# Altium project DS157-1.2-B.PrjPcb
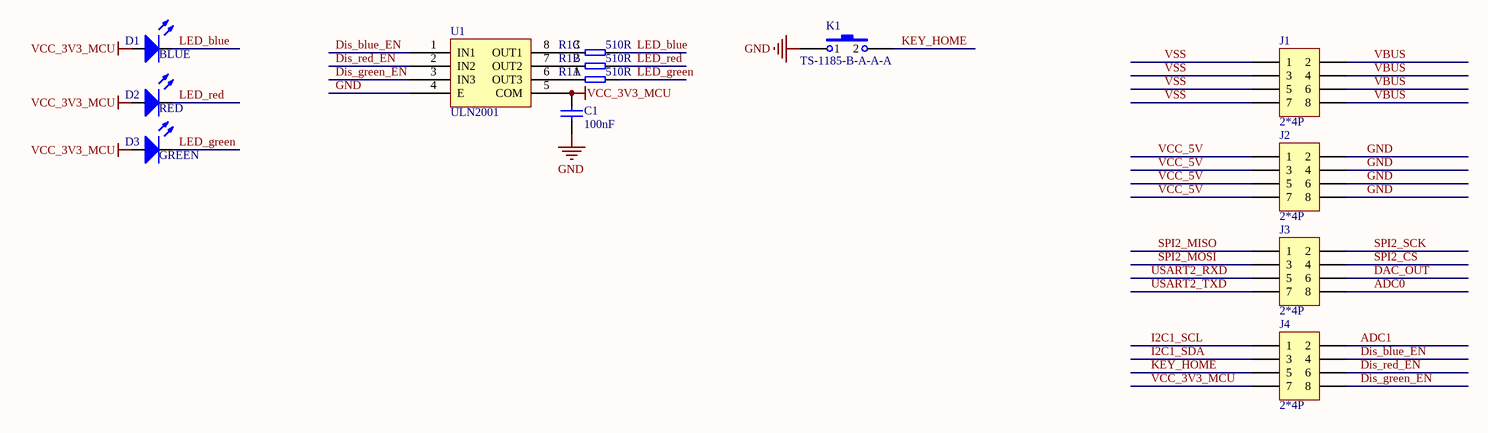
[diagram p0: DS157-1.2-B心率传感器.SchDoc]
2 sheets, 47 parts. Net scope: global (net labels, ports and power ports of the same name join across sheets).
Board files: DS157-1.2-B心率传感器.PcbDoc, DS157-1.2-C心率传感器.PcbDoc
Sheets:
  DS157-1.2-B心率传感器.SchDoc
  DS157-1.2-C心率传感器.SchDoc

## Sheet DS157-1.2-B心率传感器.SchDoc
size A4; SheetNumber: 1; SheetTotal: 1

### Parts
C1  value 100nF  [0603CAP]  (hidden comment: SMDCAP00013)
D1  value BLUE  [LED_0805]  (hidden comment: SMDLED00010)
D2  value RED  [LED_0805]  (hidden comment: SMDLED00003)
D3  value GREEN  [LED_0805]  (hidden comment: Chip 翠绿LED 0805)
J1  value 2*4P  [X1321WVS-2x04J-C40D53]  (hidden comment: X1321WVS-2x04J-C40D53)
J2  value 2*4P  [X1321WVS-2x04J-C40D53]  (hidden comment: X1321WVS-2x04J-C40D53)
J3  value 2*4P  [X1321WVS-2x04J-C40D53]  (hidden comment: X1321WVS-2x04J-C40D53)
J4  value 2*4P  [X1321WVS-2x04J-C40D53]  (hidden comment: X1321WVS-2x04J-C40D53)
K1  TS-1185-B-A-A-A  [KEY_TS-1185-x-A-A-A]
R1  value 510R  [0603RES_Pack4]  (hidden comment: SMDRES05003)  (parts A,B,C of 4)
U1  value ULN2001  [SO-8]  (hidden comment: SMDIC000018)

### Nets
GND: C1.1 J2.2 J2.4 J2.6 J2.8 K1.1 U1.4(E)
VCC_3V3_MCU: C1.2 D1.1(A) D2.1(A) D3.1(A) J4.7 U1.5(COM)
VCC_5V: J2.1 J2.3 J2.5 J2.7
ADC0: J3.8
ADC1: J4.2
DAC_OUT: J3.6
Dis_blue_EN: J4.4 U1.1(IN1)
Dis_green_EN: J4.8 U1.3(IN3)
Dis_red_EN: J4.6 U1.2(IN2)
I2C1_SCL: J4.1
I2C1_SDA: J4.3
KEY_HOME: J4.5 K1.2
LED_blue: D1.2(K) R1.6
LED_green: D3.2(K) R1.8
LED_red: D2.2(K) R1.7
SPI2_CS: J3.4
SPI2_MISO: J3.1
SPI2_MOSI: J3.3
SPI2_SCK: J3.2
USART2_RXD: J3.5
USART2_TXD: J3.7
VBUS: J1.2 J1.4 J1.6 J1.8
VSS: J1.1 J1.3 J1.5 J1.7
NetR1_1: R1.1 U1.6(OUT3)
NetR1_2: R1.2 U1.7(OUT2)
NetR1_3: R1.3 U1.8(OUT1)

### Library data of the parts
C1 = MLCC 100nF 50V ±10％ 0603: 贴片电容
D1 = Chip 蓝色LED 0805: 贴片LED
D2 = Chip 红色LED 0805: 贴片LED
D3 = Chip 翠绿LED 0805: 贴片LED
J1-J4 = X1321WVS-2x04J-C40D53: 双排针2x4P 立贴 1.27mm
K1 = TS-1185-B-A-A-A: 轻触开关; Value: TS-1185-B-A-A-A
R1 = Chip R*4 510R 1/16W ±5％ 0603: 贴片排阻
U1 = ULN2001 SOP-8: 电机驱动芯片

## Sheet DS157-1.2-C心率传感器.SchDoc
size A4; SheetNumber: 2; SheetTotal: 2
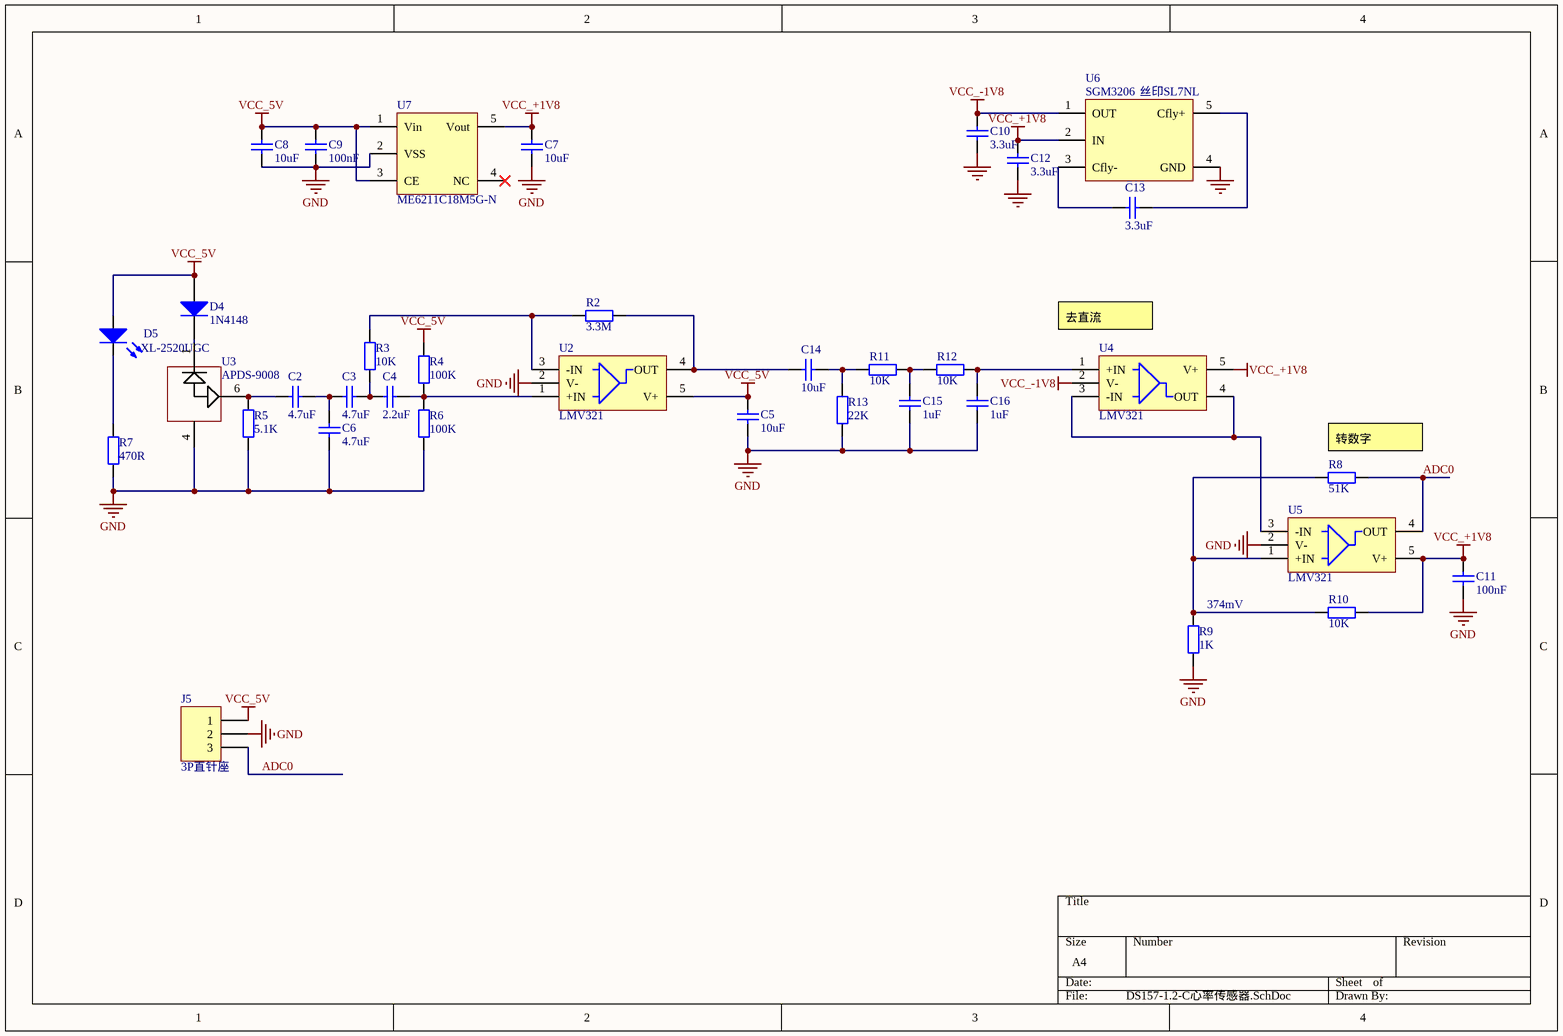
[diagram p1: DS157-1.2-C心率传感器.SchDoc]

### Parts
C2  value 4.7uF  [0603CAP]  (hidden comment: SMDCAP00012)
C3  value 4.7uF  [0603CAP]  (hidden comment: SMDCAP00012)
C4  value 2.2uF  [0603CAP]  (hidden comment: MLCC 2.2uF 25V ±10％ 0603)
C5  value 10uF  [0603CAP]  (hidden comment: SMDCAP00016)
C6  value 4.7uF  [0603CAP]  (hidden comment: SMDCAP00012)
C7  value 10uF  [0603CAP]  (hidden comment: SMDCAP00016)
C8  value 10uF  [0603CAP]  (hidden comment: SMDCAP00016)
C9  value 100nF  [0603CAP]  (hidden comment: SMDCAP00013)
C10  value 3.3uF  [0603CAP]  (hidden comment: MLCC 3.3uF 50V ±10％ 0603)
C11  value 100nF  [0603CAP]  (hidden comment: SMDCAP00013)
C12  value 3.3uF  [0603CAP]  (hidden comment: MLCC 3.3uF 50V ±10％ 0603)
C13  value 3.3uF  [0603CAP]  (hidden comment: MLCC 3.3uF 50V ±10％ 0603)
C14  value 10uF  [0603CAP]  (hidden comment: SMDCAP00016)
C15  value 1uF  [0603CAP]  (hidden comment: SMDCAP00015)
C16  value 1uF  [0603CAP]  (hidden comment: SMDCAP00015)
D4  value 1N4148  [SOD-123]  (hidden comment: DIPDIODE02001)
D5  value XL-2520UGC  [TR10]  (hidden comment: Chip 翠绿LED 0603)
J5  value 3P直针座  [XH2.54-3P]  (hidden comment: SL000000028)
R2  value 3.3M  [0603RES]  (hidden comment: SMDRES00090)
R3  value 10K  [0603RES]  (hidden comment: SMDRES00056)
R4  value 100K  [0603RES]  (hidden comment: SMDRES00071)
R5  value 5.1K  [0603RES]  (hidden comment: SMDRES00049)
R6  value 100K  [0603RES]  (hidden comment: SMDRES00071)
R7  value 470R  [0603RES]  (hidden comment: SMDRES00027)
R8  value 51K  [0603RES]  (hidden comment: Chip 51K 1/16W ±1％ 0603)
R9  value 1K  [0603RES]  (hidden comment: SMDRES00034)
R10  value 10K  [0603RES]  (hidden comment: SMDRES00056)
R11  value 10K  [0603RES]  (hidden comment: SMDRES00056)
R12  value 10K  [0603RES]  (hidden comment: SMDRES00056)
R13  value 22K  [0603RES]  (hidden comment: SMDRES00108)
U2  value LMV321  [SOT23-5]  (hidden comment: DIPIC000023)
U3  APDS-9008  [APDS-9008-020]
U4  value LMV321  [SOT23-5]  (hidden comment: DIPIC000023)
U5  value LMV321  [SOT23-5]  (hidden comment: DIPIC000023)
U6  SGM3206  value 丝印SL7NL  [SOT23-5]
U7  ME6211C18M5G-N  [SOT23-5]

### Nets
GND: C5.1 C6.1 C7.1 C8.1 C9.1 C10.2 C11.1 C12.2 C15.1 C16.1 J5.2 R5.1 R6.1 R7.1 R9.1 R13.1 U2.2(V-) U3.4(gnd) U5.2(V-) U6.4(GND) U7.2(VSS)
VCC_5V: C5.2 C8.2 C9.2 D4.1(A) D5.1(A) J5.1 R4.2 U2.5(V+) U7.1(Vin) U7.3(CE)
VCC_+1V8: C7.2 C11.2 C12.1 R10.2 U4.5(V+) U5.5(V+) U6.2(IN) U7.5(Vout)
VCC_-1V8: C10.1 U4.2(V-) U6.1(OUT)
ADC0: J5.3 R8.1 U5.4(OUT)
NetC2_1: C2.1 R5.2 U3.6(out)
NetC2_2: C2.2 C3.1 C6.2
NetC3_2: C3.2 C4.1 R3.1
NetC4_2: C4.2 R4.1 R6.2 U2.1(+IN)
NetC13_1: C13.1 U6.3(Cfly-)
NetC13_2: C13.2 U6.5(Cfly+)
NetC14_1: C14.1 R11.1 R13.2
NetC14_2: C14.2 R2.2 U2.4(OUT)
NetC15_2: C15.2 R11.2 R12.1
NetC16_2: C16.2 R12.2 U4.1(+IN)
NetD4_2: D4.2(K) U3.1(VCC)
NetD5_2: D5.2(K) R7.2
NetR2_1: R2.1 R3.2 U2.3(-IN)
NetR8_2: R8.2 R9.2 R10.1 U5.1(+IN)
NetU4_3: U4.3(-IN) U4.4(OUT) U5.3(-IN)

Not connected (* = marked no-connect by the designer): U7 4(NC)*

### Notes on the sheet
- (near U4) 去直流
- (near R8) 转数字
- (near R9) 374mV

### Library data of the parts
C2 C3 C6 = MLCC 4.7uF 50V ±10％ 0603: 贴片电容
C4 = MLCC 2.2uF 25V ±10％ 0603: 贴片电容
C5 C7 C8 C14 = MLCC 10uF 50V ±10％ 0603: 贴片电容
C9 C11 = MLCC 100nF 50V ±10％ 0603: 贴片电容
C10 C12 C13 = MLCC 3.3uF 50V ±10％ 0603: 贴片电容
C15 C16 = MLCC 1uF 50V ±10％ 0603: 贴片电容
D4 = 1N4148W: 贴片开关二极管 T4
D5 = Chip LED 0603 翠绿: 贴片LED
J5 = XH2.54mm-3A 直针座: 3P直针座
R2 = Chip 3.3M 1/16W ±1％ 0603: 贴片电阻
R3 R10-R12 = Chip 10K 1/16W ±1％ 0603: 贴片电阻
R4 R6 = Chip 100K 1/16W ±1％ 0603: 贴片电阻
R5 = Chip 5.1K 1/16W ±1％ 0603: 贴片电阻
R7 = Chip 470R 1/16W ±1％ 0603: 贴片电阻
R8 = Chip 51K 1/16W ±1％ 0603: 贴片电阻
R9 = Chip 1K 1/16W ±1％ 0603: 贴片电阻
R13 = Chip 22K 1/16W ±1％ 0603: 贴片电阻
U2 U4 U5 = LMV321: 稳压芯片
U6 = SGM3206: SGMICRO(圣邦微) / SGM3206YN5G/TR / SOT-23-5
U7 = ME6211C18M5G-N: 稳压芯片
U3 = APDS-9008: Value: APDS-9008

## Nets that join several sheets
GND: DS157-1.2-B心率传感器 (7 pins), DS157-1.2-C心率传感器 (21 pins)
VCC_5V: DS157-1.2-B心率传感器 (J2.1 J2.3 J2.5 J2.7), DS157-1.2-C心率传感器 (10 pins)
ADC0: DS157-1.2-B心率传感器 (J3.8), DS157-1.2-C心率传感器 (J5.3 R8.1 U5.4)